# EAGLE design dekodery (EAGLE 6.4)
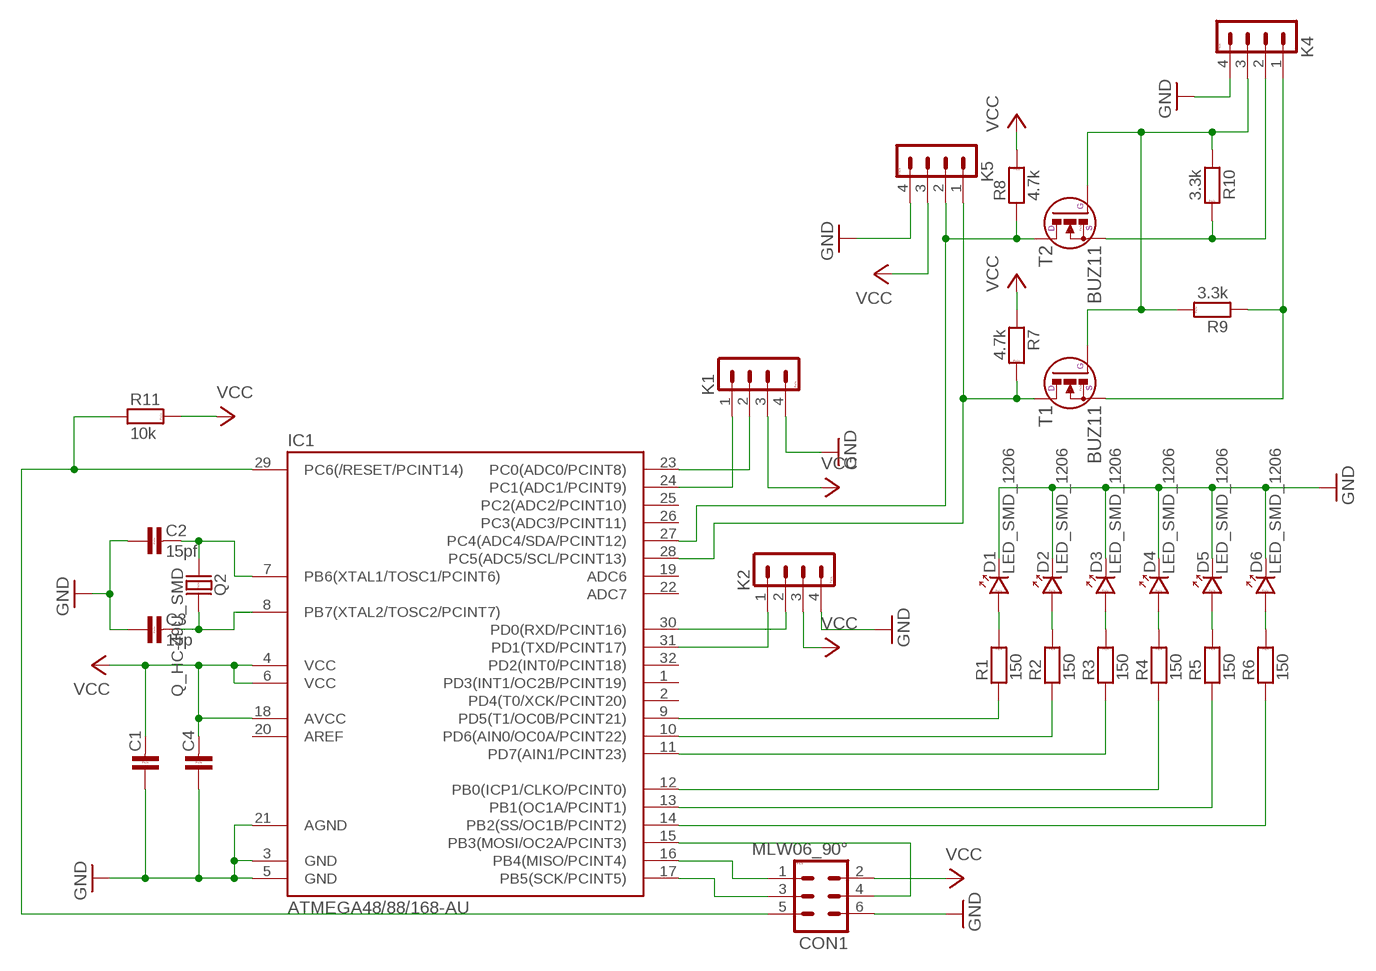
[diagram p0: schematic, sheet 1]

## Parts
C1  C-KERAMIK_SMD_1206  [1206]
C2  15pf  C-KERAMIK_SMD_1206  [1206]
C3  15p  C-KERAMIK_SMD_1206  [1206]
C4  C-KERAMIK_SMD_1206  [1206]
CON1  MLW06_90°  [MLW06A]
D1  LED_SMD_1206  [P1206]
D2  LED_SMD_1206  [P1206]
D3  LED_SMD_1206  [P1206]
D4  LED_SMD_1206  [P1206]
D5  LED_SMD_1206  [P1206]
D6  LED_SMD_1206  [P1206]
IC1  ATMEGA48/88/168-AU  [TQFP32-08]
K1  PSH02-04W  [PSH02-04W]
K2  PSH02-04W  [PSH02-04W]
K4  PSH02-04W  [PSH02-04W]
K5  PSH02-04W  [PSH02-04W]
Q2  Q_HC-49U_SMD  [HC-49US]
R1  150  R_SMD_1206  [1206]
R2  150  R_SMD_1206  [1206]
R3  150  R_SMD_1206  [1206]
R4  150  R_SMD_1206  [1206]
R5  150  R_SMD_1206  [1206]
R6  150  R_SMD_1206  [1206]
R7  4.7k  R_SMD_1206  [1206]
R8  4.7k  R_SMD_1206  [1206]
R9  3.3k  R_SMD_1206  [1206]
R10  3.3k  R_SMD_1206  [1206]
R11  10k  R_SMD_1206  [1206]
T1  BUZ11  [SOT23]
T2  BUZ11  [SOT23]

## Nets
GND: C1.1 C2.1 C3.1 C4.1 CON1.6 D1.K D2.K D3.K D4.K D5.K D6.K IC1.3(GND) IC1.5(GND) IC1.21(AGND) K1.4 K2.4 K4.4 K5.4
N$1: IC1.30(PD0(RXD/PCINT16)) K2.2
N$2: IC1.31(PD1(TXD/PCINT17)) K2.1
N$3: IC1.23(PC0(ADC0/PCINT8)) K1.2
N$4: IC1.24(PC1(ADC1/PCINT9)) K1.1
N$5: IC1.28(PC5(ADC5/SCL/PCINT13)) K5.1 R7.2 T1.3(D)
N$6: C3.2 IC1.8(PB7(XTAL2/TOSC2/PCINT7)) Q2.2
N$7: CON1.1 IC1.16(PB4(MISO/PCINT4))
N$8: CON1.3 IC1.17(PB5(SCK/PCINT5))
N$9: CON1.4 IC1.15(PB3(MOSI/OC2A/PCINT3))
N$10: IC1.9(PD5(T1/OC0B/PCINT21)) R1.1
N$11: IC1.10(PD6(AIN0/OC0A/PCINT22)) R2.1
N$12: IC1.11(PD7(AIN1/PCINT23)) R3.1
N$13: IC1.12(PB0(ICP1/CLKO/PCINT0)) R4.1
N$14: IC1.13(PB1(OC1A/PCINT1)) R5.1
N$15: IC1.14(PB2(SS/OC1B/PCINT2)) R6.1
N$16: D1.A R1.2
N$17: D6.A R6.2
N$18: D5.A R5.2
N$19: D4.A R4.2
N$20: D3.A R3.2
N$21: D2.A R2.2
N$22: C2.2 IC1.7(PB6(XTAL1/TOSC1/PCINT6)) Q2.1
N$23: IC1.27(PC4(ADC4/SDA/PCINT12)) K5.2 R8.1 T2.3(D)
N$24: K4.3 R9.2 R10.1 T1.1(G) T2.1(G)
N$26: K4.2 R10.2 T2.2(S)
N$27: K4.1 R9.1 T1.2(S)
RST: CON1.5 IC1.29(PC6(/RESET/PCINT14)) R11.1
VCC: C1.2 C4.2 CON1.2 IC1.4(VCC) IC1.6(VCC) IC1.18(AVCC) K1.3 K2.3 K5.3 R7.1 R8.2 R11.2
Unconnected: IC1.1(PD3(INT1/OC2B/PCINT19)) IC1.2(PD4(T0/XCK/PCINT20)) IC1.19(ADC6) IC1.20(AREF) IC1.22(ADC7) IC1.25(PC2(ADC2/PCINT10)) IC1.26(PC3(ADC3/PCINT11)) IC1.32(PD2(INT0/PCINT18))

## Library data of the parts
C1-C4 = #PaJa_30:C-KERAMIK: Kondenzator - keramicky
CON1 = #PaJa_konektory:MLW06: Konektory MLW - vidlice - 6x
D1-D6 = #PaJa_30:LED: LED - jednobarevna
IC1 = atmega8:ATMEGA48/88/168
K1 K2 K4 K5 = #PaJa_konektory:PSH02-04: Konektory se zamkem - vidlice - 4pin
Q2 = #PaJa_30:Q_HC-49U: Krystal - 1MHz - 48MHz
R1-R11 = #PaJa_30:R: Rezistor
T1 T2 = ondrap:BUZ11: N-Channel Enhancement MOSFET

## Board
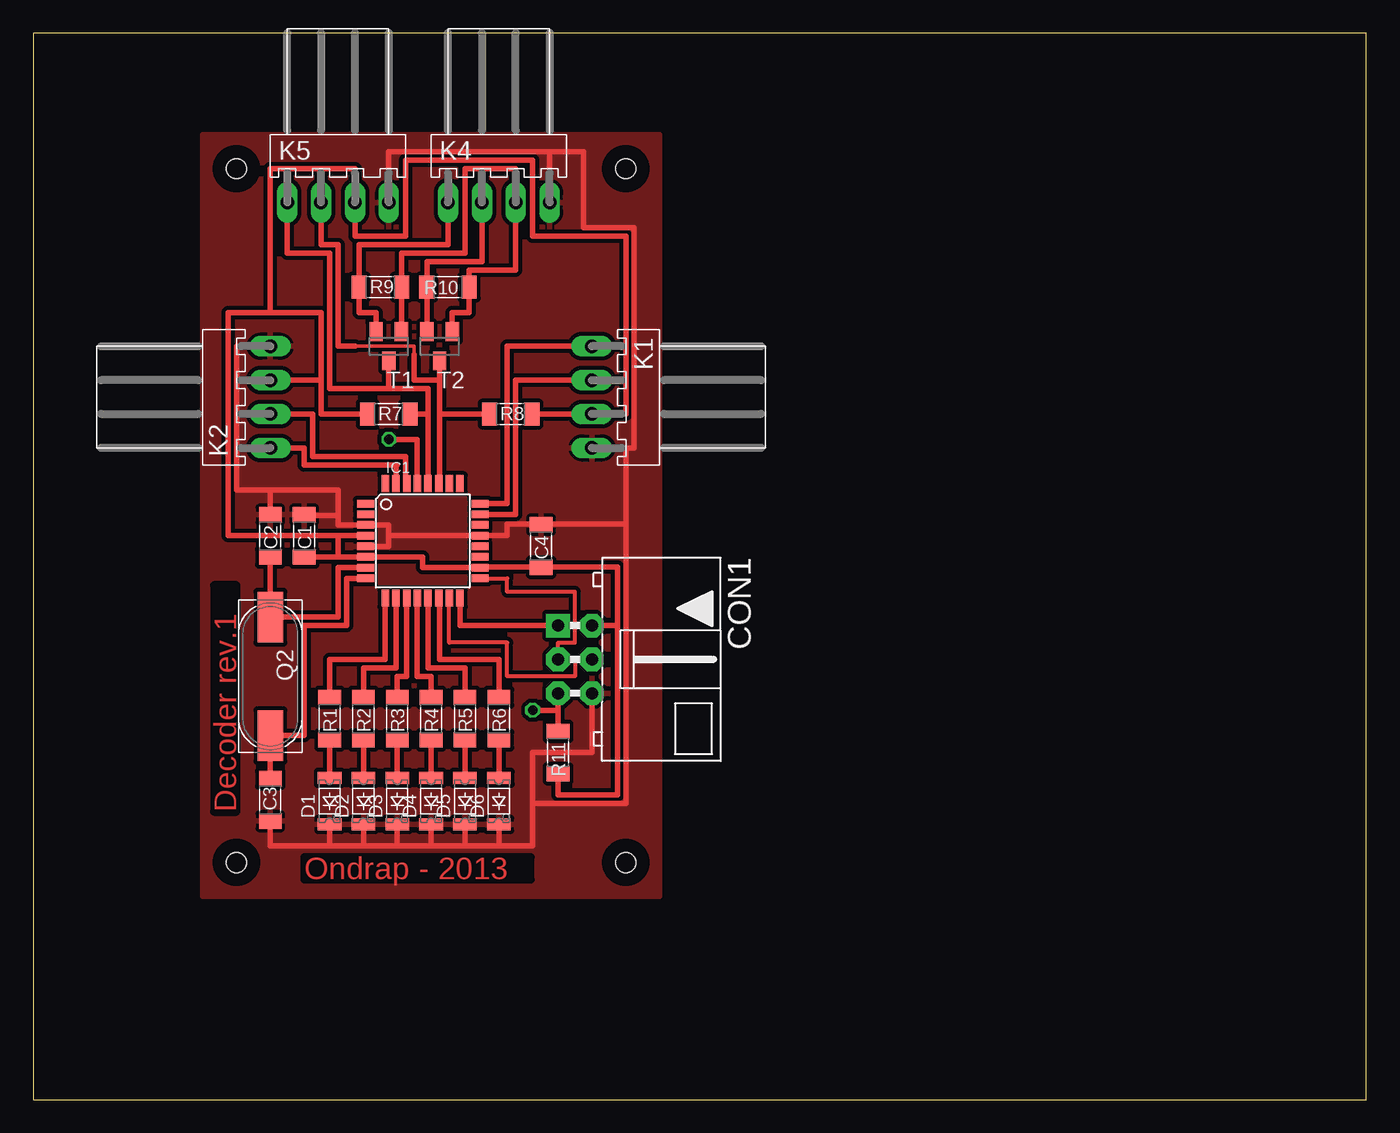
[diagram p1: board, top side]
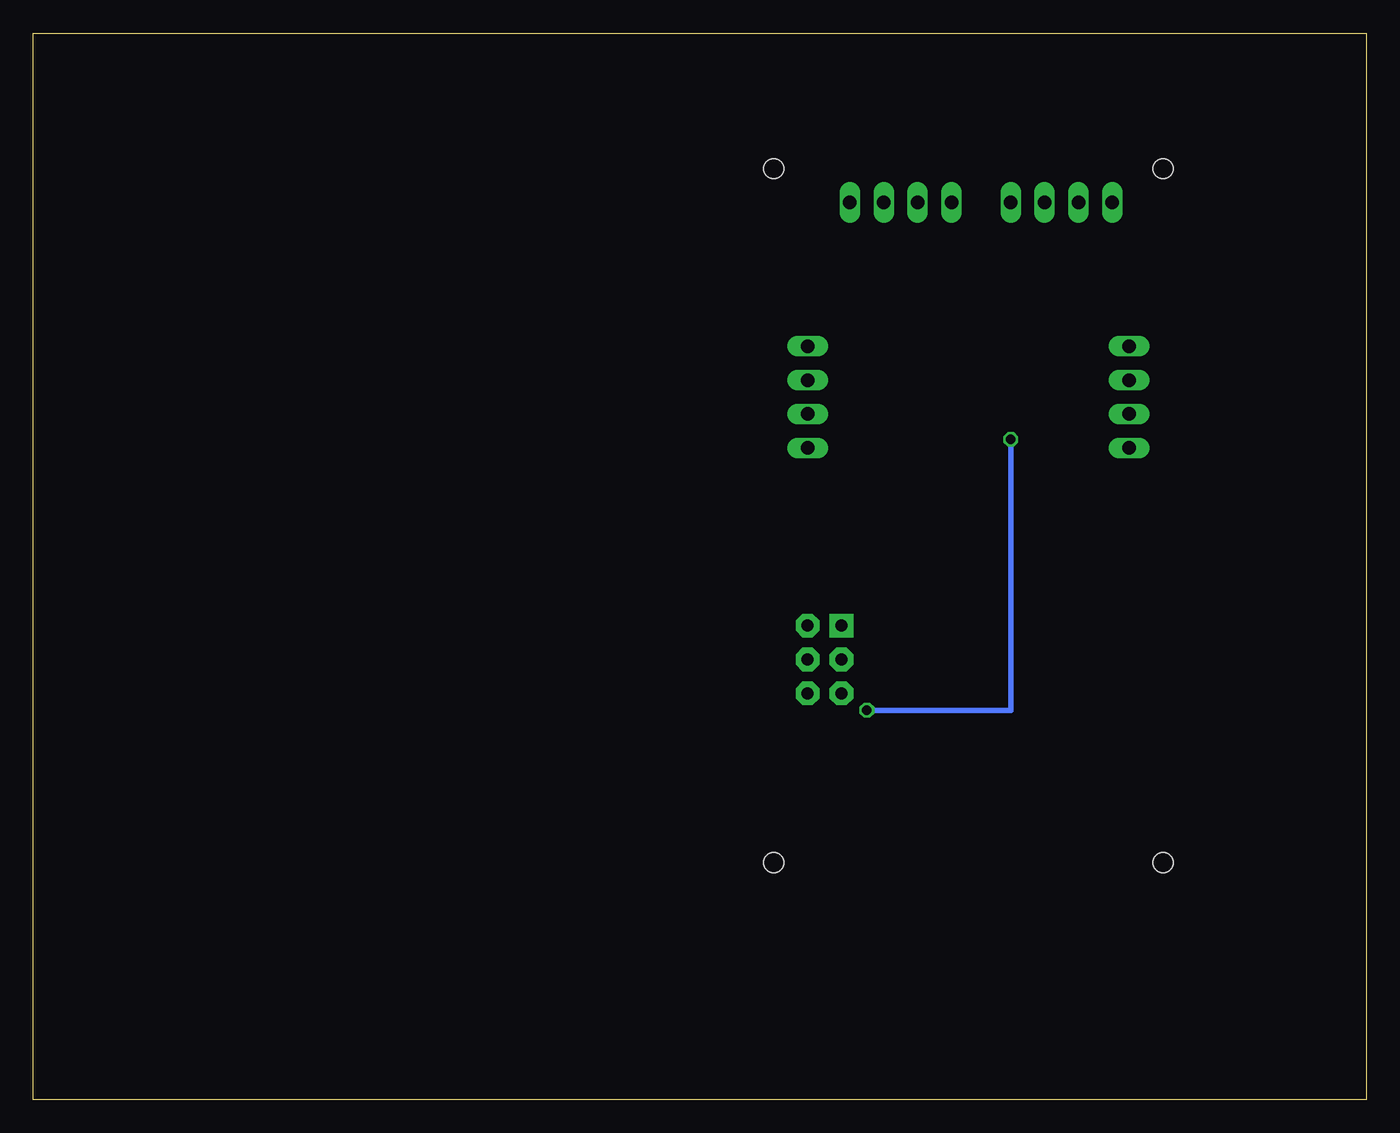
[diagram p2: board, bottom side, seen from below]

Size 100 x 80 mm. Coordinates in mm from the lower left corner, seen from the top.
Outline: 0,0 100,0 100,80 0,80 0,0
Copper layers (1*16): Top 0.035mm / dielectric 1.5mm / Bottom 0.035mm
Design rules "default": minimum track width 10mil, minimum drill 24mil, track to track 8mil, track to pad 8mil, pad to pad 8mil, via to via 8mil, smd to smd 8mil, copper to edge 40mil, drill to drill 8mil, minimum pad ring 10mil, minimum via ring 8mil, stop-mask expansion 4mil, vias tented up to drill 0mil, thermal gap 10mil
Holes 1.5 mm at 15.24,69.85 44.45,69.85 44.45,17.78 15.24,17.78

### Footprints (pad centres in the part's own frame; a part is rotated, then mirrored left to right if it is on the bottom)
1206 = smd 1.143 x 1.702: 1 -1.587,0; 2 1.587,0
MLW06A = drill 0.914 pad 1.778 square: 1 -2.54,-1.27 | drill 0.914 pad 1.778 octagon: 2 -2.54,1.27; 3 0,-1.27; 4 0,1.27; 5 2.54,-1.27; 6 2.54,1.27
P1206 = smd 0.914 x 1.778: A -1.905,0; K 1.587,0
TQFP32-08 = smd 1.27 x 0.559: 1 -4.293,2.8; 2 -4.293,2; 3 -4.293,1.2; 4 -4.293,0.4; 5 -4.293,-0.4; 6 -4.293,-1.2; 7 -4.293,-2; 8 -4.293,-2.8; 17 4.293,-2.8; 18 4.293,-2; 19 4.293,-1.2; 20 4.293,-0.4; 21 4.293,0.4; 22 4.293,1.2; 23 4.293,2; 24 4.293,2.8 | smd 0.559 x 1.27: 9 -2.8,-4.293; 10 -2,-4.293; 11 -1.2,-4.293; 12 -0.4,-4.293; 13 0.4,-4.293; 14 1.2,-4.293; 15 2,-4.293; 16 2.8,-4.293; 25 2.8,4.293; 26 2,4.293; 27 1.2,4.293; 28 0.4,4.293; 29 -0.4,4.293; 30 -1.2,4.293; 31 -2,4.293; 32 -2.8,4.293
PSH02-04W = drill 1.016 pad 1.422 long: 1 -3.81,0; 2 -1.27,0; 3 1.27,0; 4 3.81,0
HC-49US = smd 3.81 x 1.93: 1 -4.445,0; 2 4.445,0
SOT23 = smd 1 x 1.4: 1 -0.95,-1.1; 2 0.95,-1.1; 3 0,1.1

### Placement (x,y rotation side)
C1  20.32,42.29 270 top
C2  17.78,42.29 270 top
C3  17.78,22.48 90 top
C4  38.1,41.53 270 top
CON1  40.64,33.02 270 top
D1  22.23,22.23 270 top
D2  24.77,22.23 270 top
D3  27.3,22.23 270 top
D4  29.84,22.23 270 top
D5  32.38,22.23 270 top
D6  34.92,22.23 270 top
IC1  29.21,41.91 0 top
K1  41.91,52.7 270 top
K2  17.78,52.7 90 top
K4  34.92,67.31 0 top
K5  22.86,67.31 0 top
Q2  17.78,31.75 270 top
R1  22.23,28.57 270 top
R2  24.77,28.57 270 top
R3  27.3,28.57 270 top
R4  29.84,28.57 270 top
R5  32.38,28.57 270 top
R6  34.92,28.57 270 top
R7  26.67,51.44 0 top
R8  35.81,51.44 0 top
R9  26.04,60.96 0 top
R10  31.11,60.96 180 top
R11  39.37,26.04 270 top
T1  26.67,56.52 180 top
T2  30.48,56.52 180 top

### Tracks (layer width: path | path; a pad name or v marks a point on that pad's centre or on a via)
GND
  Top 0.406: D1.K 22.23,19.05 | 22.23,19.05 24.77,19.05 | 24.77,19.05 27.3,19.05 | 27.3,19.05 29.84,19.05 | 29.84,19.05 32.38,19.05 | 32.38,19.05 34.92,19.05 | 34.92,19.05 D6.K | D5.K 32.38,19.05 | D4.K 29.84,19.05 | D3.K 27.3,19.05 | D2.K 24.77,19.05 | 22.86,43.81 22.86,43.11 IC1.3 26.67,43.11 26.67,42.31 | 22.86,43.81 20.95,43.81 C1.1 | IC1.5 26.67,41.51 26.67,42.31 | C3.1 17.78,19.05 22.23,19.05 | C2.1 17.78,45.72 | 17.78,45.72 22.86,45.72 22.86,43.81 | 17.78,45.72 15.24,45.72 15.24,56.52 K2.4 | 26.67,42.31 IC1.21 35.56,42.31 35.56,43.18 38.1,43.18 | 34.92,19.05 37.47,19.05 37.47,22.23 | 37.47,22.23 37.47,26.04 41.91,26.04 CON1.6 | 38.1,43.18 C4.1 | 38.1,43.18 44.45,43.18 | K5.4 26.67,71.12 38.73,71.12 | K1.4 44.45,48.9 | 44.45,48.9 44.45,43.18 | K4.4 38.73,71.12 | 44.45,48.9 45.09,48.9 45.09,65.41 41.27,65.41 41.27,71.12 38.73,71.12 | 37.47,22.23 44.45,22.23 44.45,43.18
  pour Top (isolate 0.305): 12.7,72.39 12.7,15.24 46.99,15.24 46.99,72.39
N$1
  Top 0.406: IC1.30 27.94,46.2 27.94,48.26 20.95,48.26 20.95,51.44 K2.2
N$2
  Top 0.406: K2.1 20.32,48.9 20.32,47.62 27.21,47.62 | 27.3,47.62 27.21,47.62 | 27.21,47.62 IC1.31
N$3
  Top 0.406: IC1.23 36.2,43.91 36.2,53.98 K1.2
N$4
  Top 0.406: IC1.24 35.56,44.71 35.56,56.52 K1.1
N$5
  Top 0.406: R7.2 29.61,51.44 | IC1.28 29.61,51.44 | 26.67,53.34 29.61,53.34 29.61,51.44 | T1.3 26.67,53.34 | 26.67,53.34 22.23,53.34 22.23,63.5 19.05,63.5 K5.1
N$6
  Top 0.406: IC1.8 23.5,39.11 23.5,35.56 20.32,35.56 20.32,27.3 Q2.2 C3.2
N$7
  Top 0.406: CON1.1 32.01,35.56 IC1.16
N$8
  Top 0.305: CON1.3 39.37,34.29 40.64,34.29 40.64,38.1 35.56,38.1 35.56,39.11 IC1.17
N$9
  Top 0.305: CON1.4 40.64,33.02 40.64,31.75 35.56,31.75 35.56,34.29 31.21,34.29 IC1.15
N$10
  Top 0.406: R1.1 22.23,33.02 26.41,33.02 IC1.9
N$11
  Top 0.406: R2.1 24.77,32.38 27.21,32.38 IC1.10
N$12
  Top 0.406: R3.1 27.3,31.75 28.01,31.75 IC1.11
N$13
  Top 0.406: R4.1 29.84,31.75 28.81,31.75 IC1.12
N$14
  Top 0.406: R5.1 32.38,32.38 29.61,32.38 IC1.13
N$15
  Top 0.406: IC1.14 30.48,37.62 30.48,33.02 34.92,33.02 R6.1
N$16
  Top 0.406: R1.2 | R1.2 D1.A
N$17
  Top 0.406: D6.A | D6.A R6.2
N$18
  Top 0.406: D5.A | D5.A R5.2
N$19
  Top 0.406: D4.A | D4.A R4.2
N$20
  Top 0.406: R3.2 | R3.2 D3.A
N$21
  Top 0.406: R2.2 | R2.2 D2.A
N$22
  Top 0.406: IC1.7 22.86,39.91 22.86,36.2 Q2.1 C2.2
N$23
  Top 0.254: 28.57,55.88 28.57,56.52 24.13,56.52
  Top 0.406: IC1.27 30.48,46.2 30.48,51.44 | R8.1 30.48,51.44 | 30.48,53.98 30.48,51.44 | T2.3 30.48,53.98 | 30.48,53.98 28.57,53.98 28.57,55.88 | 24.13,56.52 22.86,56.52 22.86,64.14 21.59,64.14 K5.2
N$24
  Top 0.254: T2.1 31.11,57.62 | T1.1 27.94,57.62
  Top 0.406: T1.1 | T2.1 31.43,59.05 32.7,59.05 R10.1 | R10.1 33.02,60.96 | R10.1 32.7,62.23 36.2,62.23 K4.3 36.2,69.85 32.38,69.85 32.38,63.5 27.62,63.5 R9.2 | R9.2 27.94,60.96 | 27.94,57.62 T1.1 | T1.1 R9.2
N$26
  Top 0.406: T2.2 R10.2 29.53,62.87 33.66,62.87 K4.2
N$27
  Top 0.406: R9.1 24.77,60.96 | T1.2 25.72,59.05 24.45,59.05 R9.1 | R9.1 24.45,64.14 31.11,64.14 K4.1
RST  (via drill 0.7)
  Top 0.406: R11.1 39.37,29.21 | CON1.5 39.37,29.21 | 39.37,29.21 v37.47,29.21 | v26.67,49.53 28.81,49.53 IC1.29
  Bottom 0.406: v37.47,29.21 26.67,29.21 v26.67,49.53
VCC
  Top 0.406: 22.86,40.7 IC1.6 29.21,40.71 29.21,39.91 IC1.18 33.5,39.94 C4.2 43.81,39.94 43.81,35.56 | R7.1 21.59,51.44 21.59,53.98 | 21.59,53.98 K2.3 | R11.2 39.37,22.86 43.81,22.86 43.81,35.56 | R8.2 K1.3 44.45,51.44 44.45,64.77 37.47,64.77 37.47,70.48 27.94,70.48 27.94,64.77 24.13,64.77 K5.3 24.13,69.85 17.78,69.85 17.78,59.05 | CON1.2 43.81,35.56 | IC1.4 22.86,42.31 | 22.86,42.31 14.61,42.31 14.61,59.05 17.78,59.05 | C1.2 22.86,40.7 | 22.86,40.7 22.86,42.31 | 21.59,53.98 21.59,59.05 17.78,59.05

### Text on the board
Top: Decoder rev.1 | Ondrap - 2013